# Altium schematic sheet Drone_Center_Schematic.SchDoc
size A
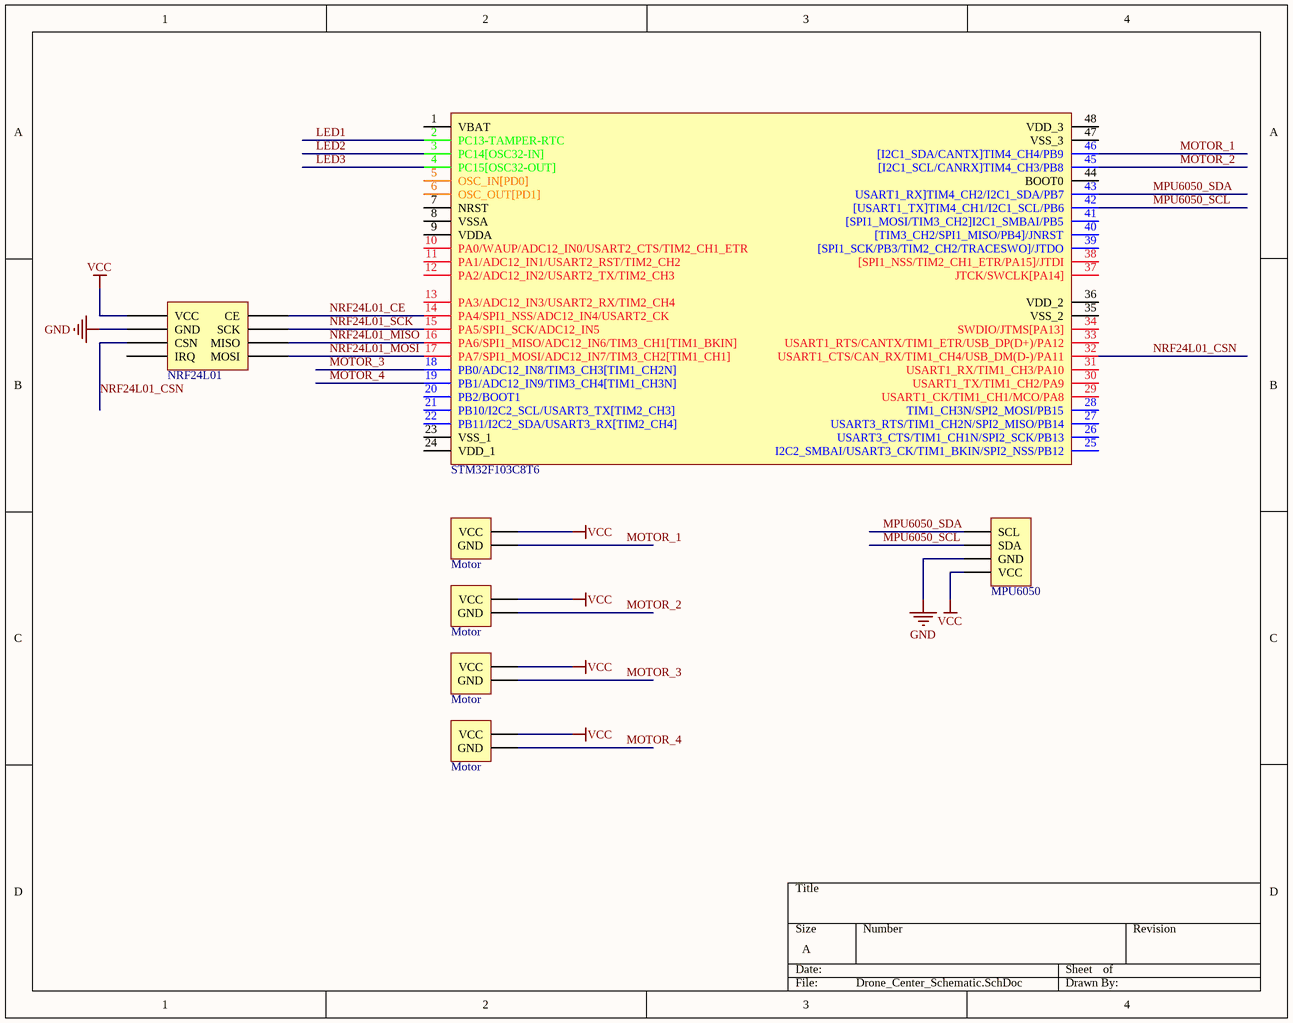
[diagram p0: Drone_Center_Schematic.SchDoc]

## Parts
(Parts that share a designator on the sheet are numbered #1, #2 ... from top to bottom, then left to right.)
*#1  MPU6050
*#2  Motor
*?#1  Motor
*?#2  Motor
*?#3  Motor
*NRF24L01  NRF24L01
STM32F103C8T6  MCU_STM32F103C8T6  (value not drawn)

## Nets
GND: *#1.30(GND) *NRF24L01.23(GND)
VCC: *#1.29(VCC) *#2.33(VCC) *?#1.33(VCC) *?#2.33(VCC) *?#3.33(VCC) *NRF24L01.22(VCC)
LED1: STM32F103C8T6.2(PC13-TAMPER-RTC)
LED2: STM32F103C8T6.3(PC14[OSC32-IN])
LED3: STM32F103C8T6.4(PC15[OSC32-OUT])
MOTOR_1: *#2.34(GND) STM32F103C8T6.46([I2C1_SDA/CANTX]TIM4_CH4/PB9)
MOTOR_2: *?#1.34(GND) STM32F103C8T6.45([I2C1_SCL/CANRX]TIM4_CH3/PB8)
MOTOR_3: *?#2.34(GND) STM32F103C8T6.18(PB0/ADC12_IN8/TIM3_CH3[TIM1_CH2N])
MOTOR_4: *?#3.34(GND) STM32F103C8T6.19(PB1/ADC12_IN9/TIM3_CH4[TIM1_CH3N])
MPU6050_SCL: *#1.31(SDA) STM32F103C8T6.42([USART1_TX]TIM4_CH1/I2C1_SCL/PB6)
MPU6050_SDA: *#1.32(SCL) STM32F103C8T6.43(USART1_RX]TIM4_CH2/I2C1_SDA/PB7)
NRF24L01_CE: *NRF24L01.18(CE) STM32F103C8T6.14(PA4/SPI1_NSS/ADC12_IN4/USART2_CK)
NRF24L01_CSN: *NRF24L01.24(CSN) STM32F103C8T6.32(USART1_CTS/CAN_RX/TIM1_CH4/USB_DM(D-)/PA11)
NRF24L01_MISO: *NRF24L01.20(MISO) STM32F103C8T6.16(PA6/SPI1_MISO/ADC12_IN6/TIM3_CH1[TIM1_BKIN])
NRF24L01_MOSI: *NRF24L01.21(MOSI) STM32F103C8T6.17(PA7/SPI1_MOSI/ADC12_IN7/TIM3_CH2[TIM1_CH1])
NRF24L01_SCK: *NRF24L01.19(SCK) STM32F103C8T6.15(PA5/SPI1_SCK/ADC12_IN5)

Not connected (* = marked no-connect by the designer): *NRF24L01 25(IRQ); STM32F103C8T6 1(VBAT) 5(OSC_IN[PD0]) 6(OSC_OUT[PD1]) 7(NRST) 8(VSSA) 9(VDDA) 10(PA0/WAUP/ADC12_IN0/USART2_CTS/TIM2_CH1_ETR) 11(PA1/ADC12_IN1/USART2_RST/TIM2_CH2) 12(PA2/ADC12_IN2/USART2_TX/TIM2_CH3) 13(PA3/ADC12_IN3/USART2_RX/TIM2_CH4) 20(PB2/BOOT1) 21(PB10/I2C2_SCL/USART3_TX[TIM2_CH3]) 22(PB11/I2C2_SDA/USART3_RX[TIM2_CH4]) 23(VSS_1) 24(VDD_1) 25(I2C2_SMBAI/USART3_CK/TIM1_BKIN/SPI2_NSS/PB12) 26(USART3_CTS/TIM1_CH1N/SPI2_SCK/PB13) 27(USART3_RTS/TIM1_CH2N/SPI2_MISO/PB14) 28(TIM1_CH3N/SPI2_MOSI/PB15) 29(USART1_CK/TIM1_CH1/MCO/PA8) 30(USART1_TX/TIM1_CH2/PA9) 31(USART1_RX/TIM1_CH3/PA10) 33(USART1_RTS/CANTX/TIM1_ETR/USB_DP(D+)/PA12) 34(SWDIO/JTMS[PA13]) 35(VSS_2) 36(VDD_2) 37(JTCK/SWCLK[PA14]) 38([SPI1_NSS/TIM2_CH1_ETR/PA15]/JTDI) 39([SPI1_SCK/PB3/TIM2_CH2/TRACESWO]/JTDO) 40([TIM3_CH2/SPI1_MISO/PB4]/JNRST) 41([SPI1_MOSI/TIM3_CH2]I2C1_SMBAI/PB5) 44(BOOT0) 47(VSS_3) 48(VDD_3)

## Library data of the parts
STM32F103C8T6 = MCU_STM32F103C8T6: IC MCU 32BIT 64KB FLASH 48LQFP;  ARM® Cortex®-M3 STM32 F1 Microcontroller IC 32-Bit 72MHz 64KB (64K x 8) FLASH; Manufacturer: STMicroelectronics; Connectivity: CAN, I²C, IrDA, LIN, SPI, UART/USART, USB; Peripherals: DMA, Motor Control PWM, PDR, POR, PVD, PWM, Temp Sensor, WDT; Number of I/O: 37; RAM Size: 20K x 8; Voltage - Supply (Vcc/Vdd): 2 V ~ 3.6 V; Data Converters: A/D 10x12b; Oscillator Type: Internal; Supplier 1: Digi-Key; Manufacturer Part Number: STM32F103C8T6; RoHS: RoHS Compliant; Category: Integrated Circuits (ICs); Stock 1: 3485; Pricing 1: 1=6.06, 10=5.438, 100=4.4558, 500=3.7931, 1000=3.199 (USD); Packaging: Tray; Part Status: Active; Core Processor: ARM® Cortex®-M3; Core Size: 32-Bit; Speed: 72MHz; Program Memory Size: 64KB (64K x 8); Program Memory Type: FLASH; EEPROM Size: -; Operating Temperature: -40°C ~ 85°C (TA); Package / Case: 48-LQFP; ComponentLink1URL: http://media.digikey.com/pdf/Data%20Sheets/ST%20Microelectronics%20PDFS/STM32F103x8,B.pdf; ComponentLink1Description: http://media.digikey.com/pdf/Data%20Sheets/ST%20Microelectronics%20PDFS/STM32F103x8,B.pdf; Supplier Part Number 1: 497-6063-ND